# EAGLE schematic temp_fan_eagle (EAGLE 7.5.0)
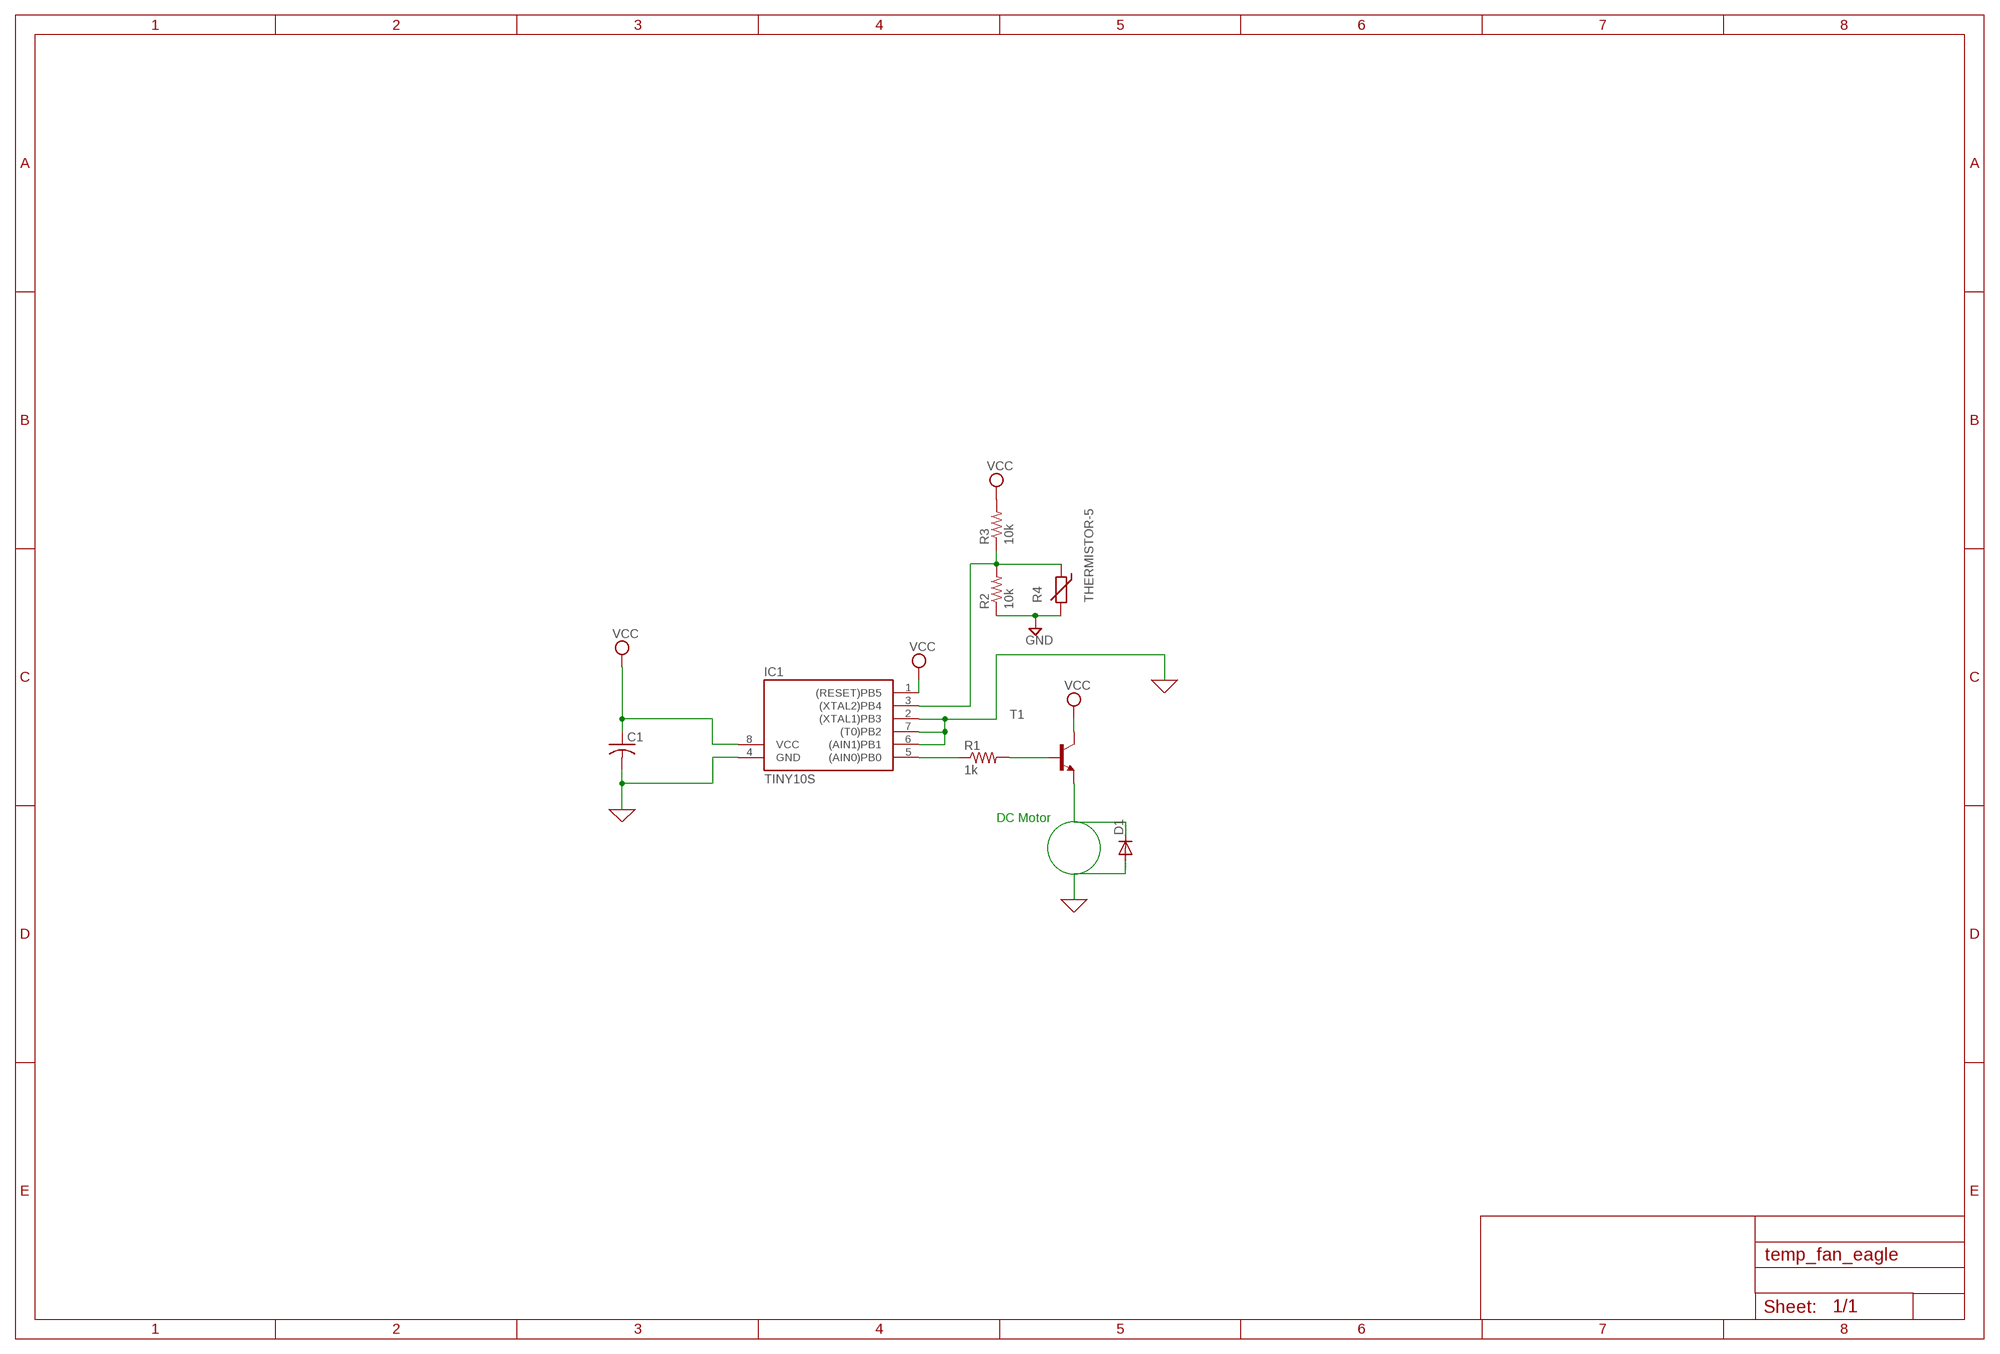
[diagram p0: schematic, sheet 1]

## Parts
C1  C-USC0603K  [C0603K]
D1  DIODE-SMB  [SMB]
IC1  TINY10S  [SOIC8]
R1  1k  R-US_M3516  [M3516]
R2  10k  R-US_M3516  [M3516]
R3  10k  R-US_M3516  [M3516]
R4  THERMISTOR-5  [R-5]
T1  MMBT3904LT1-NPN-SOT23-BEC  [SOT23-BEC]

## Nets
0: C1.2 D1.A IC1.2((XTAL1)PB3) IC1.4(GND) IC1.6((AIN1)PB1) IC1.7((T0)PB2) ; supply symbol labelled GND
GND: R2.1 R4.2
N$1: IC1.5((AIN0)PB0) R1.1
N$2: R1.2 T1.B
N$3: D1.C T1.E
N$8: IC1.3((XTAL2)PB4) R2.2 R3.1 R4.1
VCC: C1.1 IC1.1((RESET)PB5) IC1.8(VCC) R3.2 T1.C

## Notes on the sheet
- DC Motor

## Library data of the parts
C1 = resistor:C-US: CAPACITOR, American symbol
D1 = diode:DIODE-: DIODE
IC1 = atmel:TINY10: MICROCONTROLLER 1 Kbytes ROM; OC_FARNELL: unknown; OC_NEWARK: unknown
R1-R3 = resistor:R-US_: RESISTOR, American symbol
R4 = varistor:THERMISTOR: THERMISTOR
T1 = transistor-neu-to92:*-NPN-: NPN Transistror